# EAGLE design T32 ref (EAGLE 6.6.0)
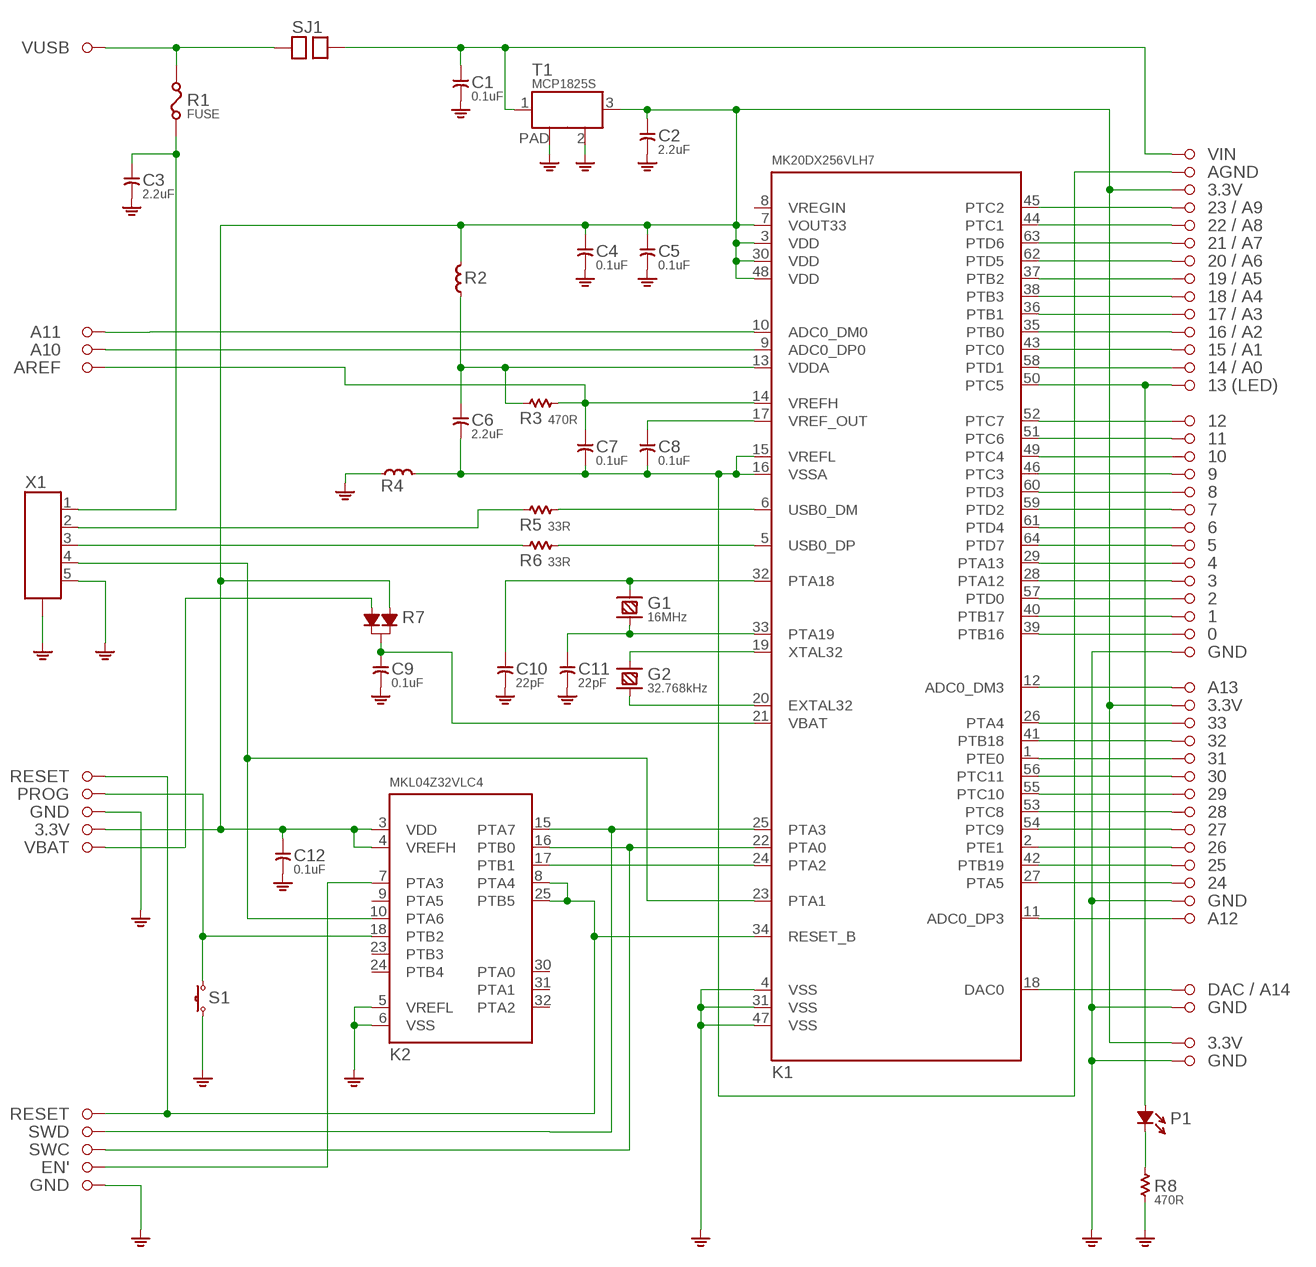
[diagram p0: schematic, sheet 1]

## Parts
C1  0.1uF  CAPACITOR-0.1UF  [C0603]
C2  2.2uF  CAPACITOR-2.2UF  [C0805]
C3  2.2uF  CAPACITOR-2.2UF  [C0805]
C4  0.1uF  CAPACITOR-0.1UF  [C0603]
C5  0.1uF  CAPACITOR-0.1UF  [C0603]
C6  2.2uF  CAPACITOR-2.2UF  [C0805]
C7  0.1uF  CAPACITOR-0.1UF  [C0603]
C8  0.1uF  CAPACITOR-0.1UF  [C0603]
C9  0.1uF  CAPACITOR-0.1UF  [C0603]
C10  22pF  CAPACITOR-22PF  [C0603]
C11  22pF  CAPACITOR-22PF  [C0603]
C12  0.1uF  CAPACITOR-0.1UF  [C0603]
G1  16MHz  CRYSTAL-HC49US  [HC49US]
G2  32.768kHz  CRYSTAL-TC26H  [TC26H]
K1  MK20DX256VLH7  [LQFP64-05]
K2  MKL04Z32VLC4  [LQFP32-08]
P1  LED  [LED-0805]
R1  FUSE  [F0805]
R2  FERRITE  [L0603]
R3  470R  RESISTOR-470R  [R0603]
R4  FERRITE  [L0603]
R5  33R  RESISTOR-33R  [R0603]
R6  33R  RESISTOR-33R  [R0603]
R7  DIODE_DUAL  [SOT-23]
R8  470R  RESISTOR-470R  [R0603]
S1  TACT_SWITCH  [ALPS_SKHH]
SJ1  SOLDERJUMPER  [SOLDERJUMPER]
SX1  PIN  [PTH_39MIL]
SX2  PIN  [PTH_39MIL]
SX3  PIN  [PTH_39MIL]
SX4  PIN  [PTH_39MIL]
SX5  PIN  [PTH_39MIL]
SX6  PIN  [PTH_39MIL]
SX7  PIN  [PTH_39MIL]
SX8  PIN  [PTH_39MIL]
SX9  PIN  [PTH_39MIL]
SX10  PIN  [PTH_39MIL]
SX11  PIN  [PTH_39MIL]
SX12  PIN  [PTH_39MIL]
SX13  PIN  [PTH_39MIL]
SX14  PIN  [PTH_39MIL]
SX15  PIN  [PTH_39MIL]
SX16  PIN  [PTH_39MIL]
SX17  PIN  [PTH_39MIL]
SX18  PIN  [PTH_39MIL]
SX19  PIN  [PTH_39MIL]
SX20  PIN  [PTH_39MIL]
SX21  PIN  [PTH_39MIL]
SX22  PIN  [PTH_39MIL]
SX23  PIN  [PTH_39MIL]
SX24  PIN  [PTH_39MIL]
SX25  PIN  [PTH_39MIL]
SX26  PIN  [PTH_39MIL]
SX27  PIN  [PTH_39MIL]
SX28  PIN  [PTH_39MIL]
SX29  PIN  [PTH_39MIL]
SX30  PIN  [PTH_39MIL]
SX31  PIN  [PTH_39MIL]
SX32  PIN  [PTH_39MIL]
SX33  PIN  [PTH_39MIL]
SX34  PIN  [PTH_39MIL]
SX35  PIN  [PTH_39MIL]
SX36  PIN  [PTH_39MIL]
SX37  PIN  [PTH_39MIL]
SX38  PIN  [PTH_39MIL]
SX39  PIN  [PTH_39MIL]
SX40  PIN  [PTH_39MIL]
SX41  PIN  [PTH_39MIL]
SX42  PIN  [PTH_39MIL]
SX43  PIN  [PTH_39MIL]
SX44  PIN  [PTH_39MIL]
SX45  PIN  [PTH_39MIL]
SX46  PIN  [PTH_39MIL]
SX47  PIN  [PTH_39MIL]
SX48  PIN  [PTH_39MIL]
SX49  PIN  [PTH_39MIL]
SX50  PIN  [PTH_39MIL]
SX51  PIN  [PTH_39MIL]
SX52  PIN  [PTH_39MIL]
SX53  PIN  [PTH_39MIL]
SX54  PIN  [PTH_39MIL]
SX55  PIN  [PTH_39MIL]
SX56  PIN  [PTH_39MIL]
SX57  PIN  [PTH_39MIL]
SX58  PIN  [PTH_39MIL]
SX59  PIN  [PTH_39MIL]
SX60  PIN  [PTH_39MIL]
T1  MCP1825S  LDO  [SOT-223]
X1  MINI-USB  MINI-USBMOLEX_0675031230  [MOLEX_SD-67503-010]

## Nets
GND: C1.2 C2.2 C3.2 C4.2 C5.2 C9.2 C10.2 C11.2 C12.2 K1.4(VSS) K1.31(VSS) K1.47(VSS) K2.5(VREFL) K2.6(VSS) R4.1 R8.1 S1.3 S1.4 SX32.1 SX42.1 SX50.1 SX53.1 SX55.1 SX60.1 T1.2(GND) T1.PAD X1.5 X1.P$1(CASE) X1.P$2(CASE) X1.P$3(CASE) X1.P$4(CASE) X1.P$5(CASE) X1.P$6(CASE)
N$1: K2.7(PTA3) SX59.1
N$2: K1.22(PTA0) K2.16(PTB0) SX58.1
N$3: K1.24(PTA2) K2.17(PTB1)
N$5: C10.1 G1.1 K1.32(PTA18)
N$6: C11.1 G1.2 K1.33(PTA19)
N$7: G2.2 K1.19(XTAL32)
N$8: G2.1 K1.20(EXTAL32)
N$9: K2.18(PTB2) S1.1 S1.2 SX40.1
N$10: K1.5(USB0_DP) R6.2
N$11: C8.1 K1.17(VREF_OUT)
N$12: K1.34(RESET_B) K2.8(PTA4) K2.25(PTB5) SX38.1 SX56.1
N$13: C7.1 K1.14(VREFH) R3.2 SX16.1
N$14: K1.6(USB0_DM) R5.2
N$15: C6.1 K1.13(VDDA) R2.1 R3.1
N$16: R6.1 X1.3
N$17: R5.1 X1.2
N$18: C3.1 R1.1 X1.1
N$19: K1.23(PTA1) K2.10(PTA6) X1.4
N$21: K1.45(PTC2) SX5.1
N$22: K1.44(PTC1) SX6.1
N$23: K1.63(PTD6) SX7.1
N$24: K1.62(PTD5) SX8.1
N$25: K1.37(PTB2) SX9.1
N$26: K1.38(PTB3) SX10.1
N$27: K1.36(PTB1) SX11.1
N$28: K1.35(PTB0) SX13.1
N$29: K1.43(PTC0) SX15.1
N$30: K1.58(PTD1) SX17.1
N$31: K1.50(PTC5) P1.+ SX18.1
N$32: K1.52(PTC7) SX19.1
N$33: K1.51(PTC6) SX20.1
N$34: K1.49(PTC4) SX21.1
N$35: K1.46(PTC3) SX22.1
N$36: K1.60(PTD3) SX23.1
N$37: K1.59(PTD2) SX24.1
N$38: K1.61(PTD4) SX25.1
N$39: K1.64(PTD7) SX26.1
N$40: K1.29(PTA13) SX27.1
N$41: K1.28(PTA12) SX28.1
N$42: K1.57(PTD0) SX29.1
N$43: K1.40(PTB17) SX30.1
N$44: K1.39(PTB16) SX31.1
N$45: K1.12(ADC0_DM3) SX33.1
N$46: K1.26(PTA4) SX35.1
N$47: K1.41(PTB18) SX36.1
N$48: K1.1(PTE0) SX37.1
N$49: K1.56(PTC11) SX39.1
N$50: K1.55(PTC10) SX41.1
N$51: K1.53(PTC8) SX43.1
N$52: P1.- R8.2
N$53: C6.2 C7.2 C8.2 K1.15(VREFL) K1.16(VSSA) R4.2 SX3.1
N$54: K1.18(DAC0) SX52.1
N$55: K1.11(ADC0_DP3) SX51.1
N$57: K1.27(PTA5) SX49.1
N$58: K1.42(PTB19) SX48.1
N$59: K1.2(PTE1) SX47.1
N$60: K1.54(PTC9) SX45.1
N$61: C1.1 SJ1.2 SX2.1 T1.1(IN)
N$63: R7.2 SX46.1
N$64: K1.10(ADC0_DM0) SX12.1
N$65: K1.9(ADC0_DP0) SX14.1
N$67: R1.2 SJ1.1 SX1.1
N$68: C9.1 K1.21(VBAT) R7.3
N$69: C2.1 C4.1 C5.1 C12.1 K1.3(VDD) K1.7(VOUT33) K1.30(VDD) K1.48(VDD) K2.3(VDD) K2.4(VREFH) R2.2 R7.1 SX4.1 SX34.1 SX44.1 SX54.1 T1.3(OUT)
N$70: K1.25(PTA3) K2.15(PTA7) SX57.1
Unconnected: K1.8(VREGIN) K2.9(PTA5) K2.23(PTB3) K2.24(PTB4) K2.30(PTA0) K2.31(PTA1) K2.32(PTA2)

## Notes on the sheet
- VUSB
- VIN
- AGND
- 3.3V
- 23 / A9
- 22 / A8
- 21 / A7
- 20 / A6
- 19 / A5
- 18 / A4
- 17 / A3
- A11 | 16 / A2
- A10 | 15 / A1
- AREF | 14 / A0
- 13 (LED)
- 12
- 11
- 10
- 9
- 8
- 7
- 6
- 5
- 4
- 3
- 2
- 1
- 0
- GND
- A13
- 3.3V
- 33
- 32
- 31
- RESET | 30
- PROG | 29
- GND | 28
- 3.3V | 27
- VBAT | 26
- 25
- 24
- GND
- A12
- DAC / A14
- GND
- 3.3V
- GND
- RESET
- SWD
- SWC
- EN'
- GND

## Library data of the parts
C1 C4 C5 C7-C9 C12 = t32_ref:CAPACITOR-0.1UF; DESC: 0.1uF / 10VDC / X7R; MF: Murata Electronics; MPN: GRM155R71A104KA01D; OC_MOUSER: 81-GRM155R71A104KA1D; PACKAGE: 0603; TYPE: Capacitor
C2 C3 C6 = t32_ref:CAPACITOR-2.2UF; DESC: 2.2uF / 25 VDC / X7R; MF: Taiyo Yuden; MPN: TMK212B7225KG-TR; OC_MOUSER: 963-TMK212B7225KG-TR; PACKAGE: 0805; TYPE: Capacitor
C10 C11 = t32_ref:CAPACITOR-22PF; DESC: 22pF / 50VDC / C0G (NP0); MF: Vishay / Vitramon; MPN: VJ0603A220JXACW1BC; OC_MOUSER: 77-VJ0603A220JXACBC; PACKAGE: 0603; TYPE: Capacitor
G1 = t32_ref:CRYSTAL-; DESC: 16MHz / 18pF / 10ppm; MF: ABRACON; MPN: ABL-16.000MHz-B1U; OC_MOUSER: 815-ABL-16-B1U; PACKAGE: HC-49US; TYPE: Crystal
G2 = t32_ref:CRYSTAL-; DESC: 32.768kHz / 12.5pF / 20ppm; MF: Citizen FineDevice; MPN: CFS206-32.768KDZF-UB; OC_MOUSER: 695-CFS206-327KF-U; PACKAGE: TC-26H; TYPE: Crystal
K1 = t32_ref:MK20DX256VLH7; DESC: MK20DX256VLH7; MF: NXP; MPN: MK20DX256VLH7; OC_MOUSER: 841-MK20DX256VLH7; PACKAGE: LQFP-64; TYPE: Microcontroller
K2 = t32_ref:MKL04Z32VLC4; DESC: MKL04Z32VLC4 (preprogrammed); MF: PJRC; MPN: IC_MKL04Z32_TQFP32; PACKAGE: LQFP-32; TYPE: Microcontroller
P1 = t32_ref:LED; DESC: orange; MF: ROHM Semiconductor; MPN: SML-211DTT86; OC_MOUSER: 755-SML-211DTT86; PACKAGE: 0805; TYPE: LED
R1 = t32_ref:FUSE; DESC: 6V / 0.5A; MF: Bel Fuse; MPN: 0ZCK0050FF2E; OC_MOUSER: 530-0ZCK0050FF2E; PACKAGE: 0805; TYPE: PPTC
R2 R4 = t32_ref:FERRITE; DESC: 600R / 100MHz; MF: Murata Electronics; MPN: BLM18AG601SN1D; OC_MOUSER: 81-BLM11A601S; PACKAGE: 0603; TYPE: Ferrite
R3 R8 = t32_ref:RESISTOR-470R; DESC: 470R / 1 % / 0.1 W; MF: Vishay; MPN: CRCW0603470RFKEA; OC_MOUSER: 71-CRCW0603-470-E3; PACKAGE: 0603; TYPE: Resistor
R5 R6 = t32_ref:RESISTOR-33R; DESC: 33R / 1% / 0.25 W; MF: Panasonic; MPN: ERJ-PA3F33R0V; OC_MOUSER: 667-ERJ-PA3F33R0V; PACKAGE: 0603; TYPE: Resistor
R7 = t32_ref:DIODE_DUAL; DESC: Dual Schottky, common cat; MF: NXP Semiconductors; MPN: BAT54C,215; OC_MOUSER: 771-BAT54C-T/R; PACKAGE: SOT-23; TYPE: Diode
S1 = t32_ref:TACT_SWITCH; DESC: SPST; MF: ALPS; MPN: SKHHPKA010; OC_MOUSER: 688-SKHHPK; PACKAGE: 6x6x5 MM; TYPE: Tactile switch
SJ1 = t32_ref:SOLDERJUMPER
SX1-SX60 = t32_ref:PIN
T1 = t32_ref:LDO; DESC: 3.3V 500mA; MF: Microchip Technology; MPN: MCP1825S-3302E/DB; OC_MOUSER: 579-MCP1825S-3302EDB; PACKAGE: SOT-223-3; TYPE: Voltage regulator
X1 = t32_ref:MINI-USB; DESC: MINI USB; MF: MOLEX; MPN: 0675031020; OC_MOUSER: 538-67503-1020; TYPE: Mini USB

## Board
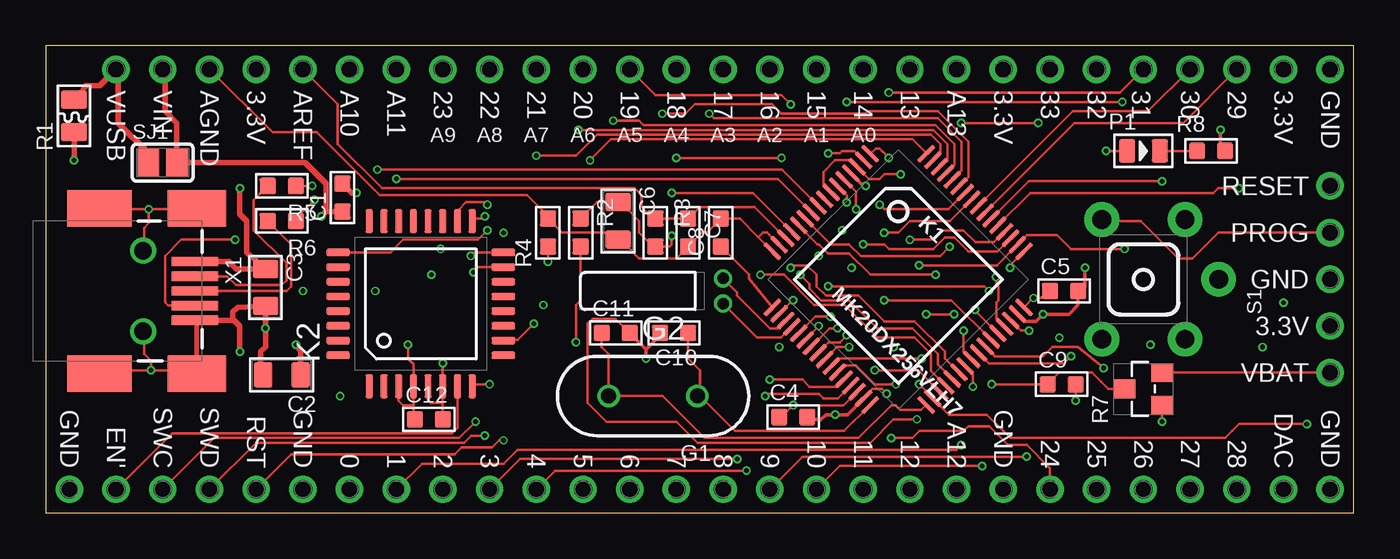
[diagram p1: board, top side]
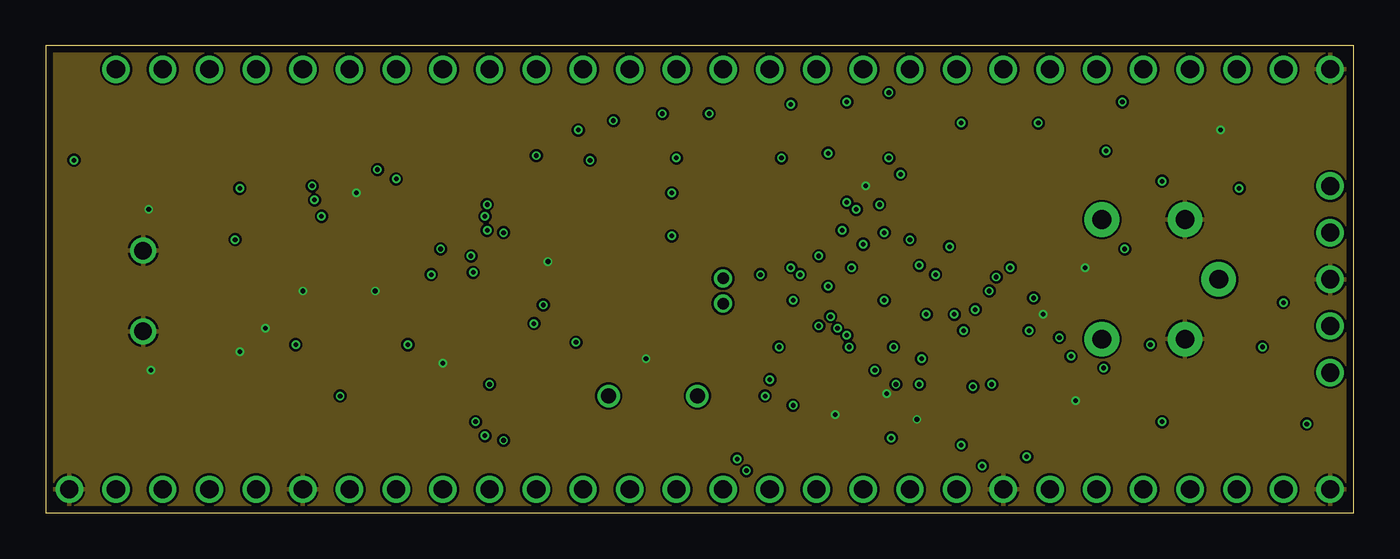
[diagram p2: board, inner layer Route2]
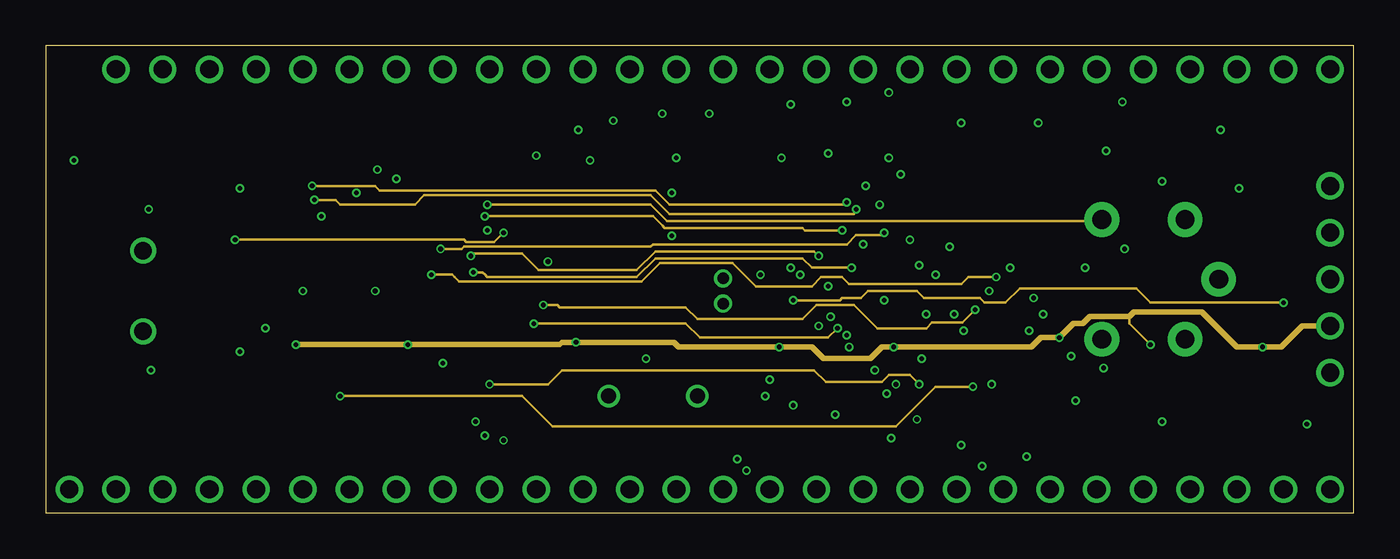
[diagram p3: board, inner layer Route15]
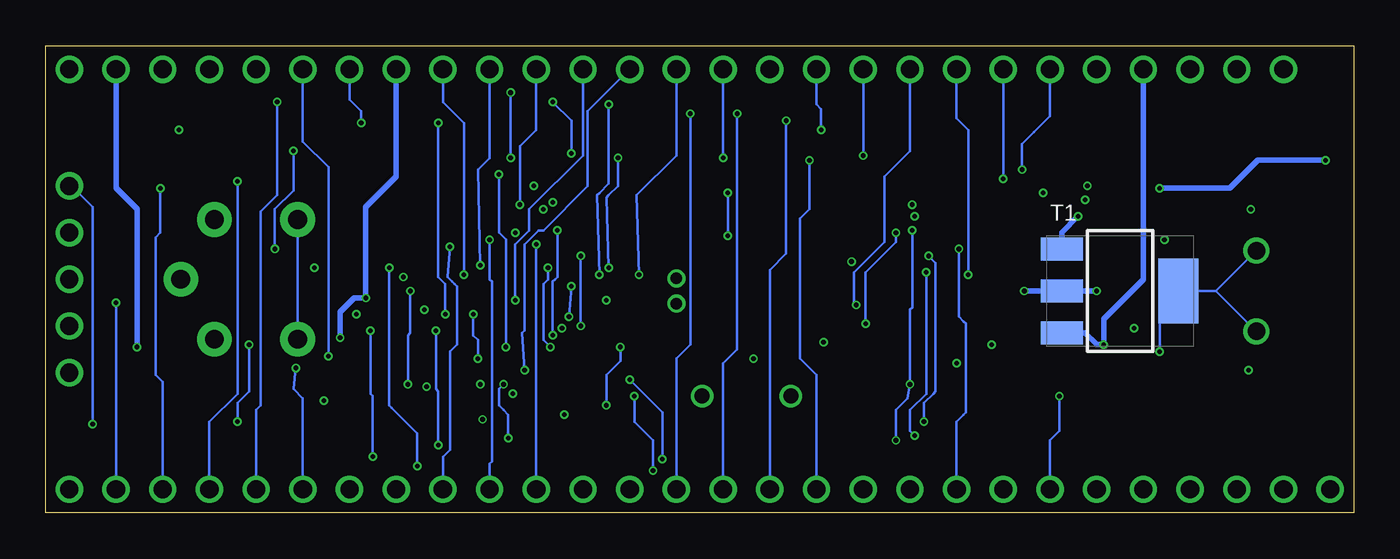
[diagram p4: board, bottom side, seen from below]

Size 71.12 x 25.4 mm. Coordinates in mm from the lower left corner, seen from the top.
Outline: 0,0 71.12,0 71.12,25.4 0,25.4 0,0
Copper layers (1+2*15+16): Top 0.035559375mm / dielectric 0.17018125mm / Route2 0.01778125mm / dielectric 47mil / Route15 0.01778125mm / dielectric 0.17018125mm / Bottom 0.035559375mm
Design rules "oshpark-4layer *": minimum track width 5mil, minimum drill 10mil, track to track 5mil, track to pad 5mil, pad to pad 5mil, via to via 5mil, smd to smd 5mil, copper to edge 15mil, drill to drill 5mil, minimum pad ring 7mil, minimum via ring 4mil, stop-mask expansion 3mil, vias tented up to drill 20mil, thermal gap 5mil

### Footprints (pad centres in the part's own frame; a part is rotated, then mirrored left to right if it is on the bottom)
C0603 = smd 0.889 x 0.889: 1 0,0.762; 2 0,-0.762
C0805 = smd 1.397 x 1.016: 1 0,1.016; 2 0,-1.016
HC49US = drill 0.813: 1 -2.413,0; 2 2.413,0
TC26H = drill 0.635: 1 -0.686,0; 2 0.686,0
LQFP64-05 = smd 1.2 x 0.25: 1 -5.915,3.759; 2 -5.915,3.251; 3 -5.915,2.743; 4 -5.915,2.261; 5 -5.915,1.753; 6 -5.915,1.245; 7 -5.915,0.762; 8 -5.915,0.254; 9 -5.915,-0.254; 10 -5.915,-0.762; 11 -5.915,-1.245; 12 -5.915,-1.753; 13 -5.915,-2.261; 14 -5.915,-2.743; 15 -5.915,-3.251; 16 -5.915,-3.759; 33 5.915,-3.759; 34 5.915,-3.251; 35 5.915,-2.743; 36 5.915,-2.261; 37 5.915,-1.753; 38 5.915,-1.245; 39 5.915,-0.762; 40 5.915,-0.254; 41 5.915,0.254; 42 5.915,0.762; 43 5.915,1.245; 44 5.915,1.753; 45 5.915,2.261; 46 5.915,2.743; 47 5.915,3.251; 48 5.915,3.759 | smd 0.25 x 1.2: 17 -3.759,-5.915; 18 -3.251,-5.915; 19 -2.743,-5.915; 20 -2.261,-5.915; 21 -1.753,-5.915; 22 -1.245,-5.915; 23 -0.762,-5.915; 24 -0.254,-5.915; 25 0.254,-5.915; 26 0.762,-5.915; 27 1.245,-5.915; 28 1.753,-5.915; 29 2.261,-5.915; 30 2.743,-5.915; 31 3.251,-5.915; 32 3.759,-5.915; 49 3.759,5.915; 50 3.251,5.915; 51 2.743,5.915; 52 2.261,5.915; 53 1.753,5.915; 54 1.245,5.915; 55 0.762,5.915; 56 0.254,5.915; 57 -0.254,5.915; 58 -0.762,5.915; 59 -1.245,5.915; 60 -1.753,5.915; 61 -2.261,5.915; 62 -2.743,5.915; 63 -3.251,5.915; 64 -3.759,5.915
LQFP32-08 = smd 1.3 x 0.4: 1 -4.493,2.8; 2 -4.493,2; 3 -4.493,1.2; 4 -4.493,0.4; 5 -4.493,-0.4; 6 -4.493,-1.2; 7 -4.493,-2; 8 -4.493,-2.8; 17 4.493,-2.8; 18 4.493,-2; 19 4.493,-1.2; 20 4.493,-0.4; 21 4.493,0.4; 22 4.493,1.2; 23 4.493,2; 24 4.493,2.8 | smd 0.4 x 1.3: 9 -2.8,-4.493; 10 -2,-4.493; 11 -1.2,-4.493; 12 -0.4,-4.493; 13 0.4,-4.493; 14 1.2,-4.493; 15 2,-4.493; 16 2.8,-4.493; 25 2.8,4.493; 26 2,4.493; 27 1.2,4.493; 28 0.4,4.493; 29 -0.4,4.493; 30 -1.2,4.493; 31 -2,4.493; 32 -2.8,4.493
LED-0805 = smd 0.889 x 1.27: + -0.889,0; - 0.889,0
F0805 = smd 1.397 x 1.016: 1 0,0.889; 2 0,-0.889
L0603 = smd 0.889 x 0.889: 1 -0.762,0; 2 0.762,0
R0603 = smd 0.889 x 0.889: 1 0,0.762; 2 0,-0.762
SOT-23 = smd 1.016 x 1.143: 1 -0.889,-1.016; 2 0.889,-1.016; 3 0,1.016
ALPS_SKHH = drill 1.016 pad 1.88: 1 -3.251,2.261; 2 3.251,2.261; 3 -3.251,-2.261; 4 3.251,-2.261; 5 0,-4.1
SOLDERJUMPER = smd 1.168 x 1.6: 1 -0.762,0; 2 0.762,0
PTH_39MIL = drill 0.991: 1 0,0
SOT-223 = smd 1.27 x 2.286: 1 -2.286,-3.175; 2 0,-3.175; 3 2.286,-3.175 | smd 3.556 x 2.159: PAD 0,3.175
MOLEX_SD-67503-010 = smd 2.54 x 0.508: 1 2.819,1.6; 2 2.819,0.8; 3 2.819,0; 4 2.819,-0.8; 5 2.819,-1.6 | smd 3.5 x 2: P$1 -2.375,-4.5; P$2 -2.375,4.5 | smd 3.2 x 2: P$3 2.925,-4.5; P$4 2.925,4.5 | drill 0.95: P$5 0,2.2; P$6 0,-2.2

### Placement (x,y rotation side)
C1  16.13,17.14 180 top
C2  12.83,7.49 270 top
C3  11.94,12.26 0 top
C4  40.64,5.21 90 top
C5  55.37,12.06 90 top
C6  31.11,15.88 0 top
C7  34.92,15.24 0 top
C8  36.7,15.24 180 top
C9  55.24,6.99 90 top
C10  34.16,9.78 270 top
C11  30.99,9.78 90 top
C12  20.83,5.08 90 top
G1  33.02,6.35 180 top
G2  36.83,12.06 90 top
K1  46.35,12.7 315 top
K2  20.38,11.37 90 top
P1  59.69,19.68 0 top
R1  1.52,21.59 180 top
R2  29.08,15.24 270 top
R3  33.15,15.24 180 top
R4  27.3,15.24 90 top
R5  12.83,17.78 90 top
R6  12.83,15.88 90 top
R7  59.69,6.73 90 top
R8  63.37,19.68 270 top
S1  59.69,12.7 90 top
SJ1  6.35,19.05 0 top
SX1  3.81,24.13 0 top
SX2  6.35,24.13 0 top
SX3  8.89,24.13 0 top
SX4  11.43,24.13 0 top
SX5  21.59,24.13 0 top
SX6  24.13,24.13 0 top
SX7  26.67,24.13 0 top
SX8  29.21,24.13 0 top
SX9  31.75,24.13 0 top
SX10  34.29,24.13 0 top
SX11  36.83,24.13 0 top
SX12  19.05,24.13 0 top
SX13  39.37,24.13 0 top
SX14  16.51,24.13 0 top
SX15  41.91,24.13 0 top
SX16  13.97,24.13 0 top
SX17  44.45,24.13 0 top
SX18  46.99,24.13 0 top
SX19  46.99,1.27 0 top
SX20  44.45,1.27 0 top
SX21  41.91,1.27 0 top
SX22  39.37,1.27 0 top
SX23  36.83,1.27 0 top
SX24  34.29,1.27 0 top
SX25  31.75,1.27 0 top
SX26  29.21,1.27 0 top
SX27  26.67,1.27 0 top
SX28  24.13,1.27 0 top
SX29  21.59,1.27 0 top
SX30  19.05,1.27 0 top
SX31  16.51,1.27 0 top
SX32  13.97,1.27 0 top
SX33  49.53,24.13 0 top
SX34  52.07,24.13 0 top
SX35  54.61,24.13 0 top
SX36  57.15,24.13 0 top
SX37  59.69,24.13 0 top
SX38  69.85,17.78 0 top
SX39  62.23,24.13 0 top
SX40  69.85,15.24 0 top
SX41  64.77,24.13 0 top
SX42  69.85,12.7 0 top
SX43  64.77,1.27 0 top
SX44  69.85,10.16 0 top
SX45  62.23,1.27 0 top
SX46  69.85,7.62 0 top
SX47  59.69,1.27 0 top
SX48  57.15,1.27 0 top
SX49  54.61,1.27 0 top
SX50  52.07,1.27 0 top
SX51  49.53,1.27 0 top
SX52  67.31,1.27 0 top
SX53  1.27,1.27 0 top
SX54  67.31,24.13 0 top
SX55  69.85,24.13 0 top
SX56  11.43,1.27 0 top
SX57  8.89,1.27 0 top
SX58  6.35,1.27 0 top
SX59  3.81,1.27 0 top
SX60  69.85,1.27 0 top
T1  12.7,12.06 270 bottom
X1  5.29,12.06 0 top

### Tracks (layer width: path | path; a pad name or v marks a point on that pad's centre or on a via)
GND  (via drill 0.25)
  Top 0.127: 21.58,5.97 K2.6 v21.58,8.12 v21.59,8.13 | 21.58,5.97 21.58,5.16 C12.2 | K2.5 20.78,6.14 20.95,5.97 21.58,5.97 | C4.2 41.53,5.08 | C10.2 33.4,9.65 | v47.37,5.08 46.1,5.08 44.83,3.81 35.43,3.81 34.29,4.95 30.48,4.95 29.46,5.97 29.46,10.29 29.72,10.54 30.99,10.54 C11.2 | 11.68,7.75 C2.2 | C5.2 56.52,12.32 | C9.2 v56.01,6.1 | K1.47 52.7,10.93 | R4.1 v27.3,13.66 | R8.1 64.14,19.81 63.88,20.07 | C1.2 16.26,17.91 | 44.45,6.22 44.7,6.48 44.96,6.73 45.09,6.73 45.21,6.73 45.47,6.73 v45.72,6.48 | v5.59,16.51 2.97,16.51 X1.P$2 | v5.59,16.51 8.16,16.51 X1.P$4 | v5.71,7.75 8.03,7.75 X1.P$3 | v5.71,7.75 3.09,7.75 X1.P$1 | v5.71,7.75 5.71,8.26 5.33,8.64 5.33,9.91 | v5.59,16.51 5.59,15.75 5.33,15.49 5.33,14.22
  Top 0.203: 41.53,5.08 42.16,5.08 42.42,5.33 v42.93,5.33 43.59,5.33 K1.31 | C11.2 32.64,8.89 | 33.4,9.65 32.64,8.89 | 32.64,8.89 v32.64,8.38 | 56.52,12.32 v56.52,13.34 | 52.7,10.93 53.21,10.41 53.85,10.41 v54.23,10.79 55.63,10.79 56.13,11.3 C5.2 | 63.88,20.07 v63.88,20.83 | K1.4 44.47,17.78 v44.58,17.78
  Top 0.254: X1.P$3 8.21,10.5 8.26,10.54
  Top 0.305: 11.68,7.75 11.68,8.76 11.94,9.02 v11.94,10.03 C3.2 10.41,11.18 10.16,10.92 10.16,10.54 | X1.5 10.24,10.46 10.54,10.16 v10.54,8.76 | v16.89,17.4 16.64,17.4 C1.2
  Route2 0.127: v42.93,5.33 42.93,5.46
  Bottom 0.127: v10.54,8.76 10.54,10.41 9.53,11.43 T1.PAD 7.49,12.06 | 5.33,14.22 7.49,12.06 | 5.33,9.91 7.49,12.06
  Bottom 0.305: v17.91,12.06 T1.2 v13.97,12.06
  pour Route2: -3.56,27.56 -3.68,27.56 -3.68,-2.03 76.71,-2.03 76.71,27.69 -3.56,27.69
N$1
  Top 0.127: SX59.1 6.86,4.32 9.4,4.32 22.1,4.32 22.38,4.6 K2.7
N$2  (via drill 0.25)
  Top 0.127: SX58.1 9.14,4.06 22.48,4.06 v23.37,4.95 | 23.24,14.1 v23.11,13.97 23.31,14.17 K2.16 | K1.22 41.43,9.56 v42.04,10.16
  Route15 0.127: v42.04,13.97 41.78,14.22 33.15,14.22 32.13,13.21 26.8,13.21 25.91,14.1 23.24,14.1 v23.11,13.97
  Bottom 0.127: v23.37,4.95 23.37,5.97 22.86,6.48 22.73,6.6 22.73,13.59 v23.11,13.97 | v42.04,10.16 42.04,13.84 v42.04,13.97
N$3  (via drill 0.25)
  Top 0.127: 42.13,8.86 K1.24 42.57,9.27 43.18,9.27 v43.56,9.65 | v23.88,16.13 23.75,16 23.27,16 K2.17
  Route15 0.127: v43.31,15.37 41.27,15.37 41.15,15.49 38.61,15.49 33.66,15.49 33.53,15.62 33.02,16.13 v23.88,16.13
  Bottom 0.127: v43.56,9.65 43.56,12.57 43.43,12.7 43.31,12.83 v43.31,15.37
N$5
  Top 0.127: C10.1 34.92,8.38 35.56,7.75 35.56,6.48 G1.1 35.56,6.35 37.47,4.45 43.42,4.45 K1.32
N$6
  Top 0.127: C11.1 30.23,9.02 30.61,8.64 G1.2 33.53,6.35 35.81,4.06 44.2,4.06 45.97,5.84 46.23,5.84 46.48,5.59 47.58,5.59 K1.33
N$7
  Top 0.127: K1.19 39.81,10.03 39.5,10.03 39.37,10.03 37.59,11.81 37.59,11.99 G2.2
N$8
  Top 0.127: K1.20 39.98,9.53 38.73,9.53 38.68,9.53 G2.1
N$9  (via drill 0.25)
  Top 0.127: SX40.1 63.75,15.24 62.36,13.84 61.59,13.84 59.56,15.88 57.99,15.88 S1.2 | K2.18 22.38,16.41 22.86,16.89 23.88,16.89 v24,16.76
  Route15 0.127: v24,16.76 32.89,16.76 33.78,15.88 41.4,15.88 41.66,15.88 41.91,15.88 56.84,15.88 S1.2
  Bottom 0.127: S1.1 S1.2
N$10  (via drill 0.25)
  Top 0.127: R6.2 13.59,16 v14.61,17.02 | v44.07,16.51 44.07,17.46 K1.5
  Route15 0.127: v14.61,17.02 15.75,17.02 16,16.76 20.07,16.76 20.57,17.27 32.89,17.27 33.91,16.26 41.91,16.26 42.16,16.26 43.94,16.26 v44.07,16.51
N$11
  Top 0.127: K1.17 38.23,12.75 38.23,12.95 C8.1
N$12  (via drill 0.25)
  Top 0.127: SX56.1 13.34,3.17 22.23,3.17 22.61,3.56 24.26,3.56 24.64,3.94 v24.89,3.94 | v24.13,6.99 23.27,6.99 K2.8 | v24,15.37 23.5,14.86 19.43,14.86 18.74,14.17 K2.25 | v47.5,6.99 48.1,6.39 K1.34 49.12,5.33 51.18,5.33 52.07,4.45 52.45,4.06 64.14,4.06 64.52,4.45 64.9,4.83 v68.58,4.83
  Route15 0.127: v24.13,6.99 27.3,6.99 28.07,7.75 41.78,7.75 42.42,7.11 45.47,7.11 45.85,7.49 46.99,7.49 v47.5,6.99
  Bottom 0.127: v24.89,3.94 24.89,5.59 24.26,6.22 v24.13,6.99 24.13,11.05 24,11.18 v24,15.37 | SX38.1 69.72,17.78 68.58,16.64 v68.58,4.83
N$13
  Top 0.127: SX16.1 15.88,22.23 15.88,20.07 18.29,17.65 32,17.65 32.38,17.27 32.38,16.64 33.02,16 R3.2 C7.1 35.56,16.64 38.54,16.64 K1.14
N$14  (via drill 0.25)
  Top 0.127: R5.2 v14.48,17.78 | v43.56,16.89 43.56,17.25 K1.6
  Route15 0.127: v14.48,17.78 17.91,17.78 18.16,17.53 33.15,17.53 33.91,16.76 38.48,16.76 38.73,16.76 43.43,16.76 v43.56,16.89
N$15  (via drill 0.25)
  Top 0.127: K1.13 38.46,17.4 35.94,17.4 v34.04,17.4 | v34.04,15.06 34.04,14.61 33.91,14.48 R3.1 33.02,14.48 32.26,15.24 32.26,15.88 31.62,16.51 31.5,16.51 C6.1 29.97,16.89 R2.1
  Bottom 0.127: v34.04,17.4 v34.04,15.06
N$16
  Top 0.127: X1.3 13.08,12.06 13.34,12.32 13.34,14.61 R6.1
N$17
  Top 0.127: X1.2 9.87,12.87 10.35,12.38 12.83,12.38 13.08,12.64 13.08,13.59 11.3,15.37 11.3,17.02 R5.1
N$18  (via drill 0.25)
  Top 0.305: R1.1 v1.52,19.18 | v10.54,17.65 10.54,16.26 10.92,15.88 10.92,14.16 C3.1 10.35,13.27 9.96,13.66 X1.1
  Bottom 0.305: v1.52,19.18 5.21,19.18 6.73,17.65 v10.54,17.65
N$19  (via drill 0.25)
  Top 0.127: K2.10 24.71,9.4 25.65,9.4 v26.54,10.29 | 10.16,14.73 v10.29,14.86 7.37,14.86 6.48,13.97 6.48,13.21 6.48,11.43 6.64,11.27 X1.4 | v43.05,10.03 42.61,10.03 K1.23
  Route15 0.127: v24.89,15.24 24.38,14.73 22.86,14.73 22.73,14.86 17.14,14.86 v10.29,14.86 | v26.54,10.29 34.8,10.29 35.56,9.53 42.55,9.53 v43.05,10.03
  Bottom 0.127: v24.89,15.24 24.89,14.73 26.54,13.08 v26.54,10.29
N$21  (via drill 0.25)
  Top 0.127: K1.45 51.69,10.56 51.69,10.94 51.69,11.07 51.69,11.43 51.82,11.56 51.82,12.32 51.69,12.45 v51.69,12.83
  Route15 0.127: v51.69,12.83 50.16,12.83 49.78,12.45 43.69,12.45 43.31,12.83 42.16,12.83 41.66,12.32 38.61,12.32 37.34,13.59 33.4,13.59 32.38,12.57 22.48,12.57 22.23,12.83 22.1,12.95 v20.95,12.95
  Bottom 0.127: SX5.1 21.59,21.46 20.95,20.83 v20.95,12.95
N$22  (via drill 0.25)
  Top 0.127: K1.44 50.55,10.99 v50.55,11.05
  Route15 0.127: v50.55,11.05 49.85,10.35 48.2,10.35 47.88,10.03 45.21,10.03 43.94,11.3 41.91,11.3 41.15,10.54 40.77,10.54 36.07,10.54 35.43,10.54 34.8,11.18 27.94,11.18 27.81,11.3 v27.05,11.3
  Bottom 0.127: SX6.1 24.13,19.68 25.53,18.29 25.53,14.73 27.18,13.08 27.18,11.43 v27.05,11.3
N$23  (via drill 0.25)
  Top 0.127: v26.67,19.43 28.83,19.43 29.97,20.57 48.13,20.57 48.64,20.07 48.64,19.58 K1.63
  Bottom 0.127: SX7.1 v26.67,19.43
N$24  (via drill 0.25)
  Top 0.127: v28.96,20.83 48.26,20.83 49.02,20.07 49.02,19.25 K1.62
  Bottom 0.127: SX8.1 29.21,22.23 28.96,21.97 v28.96,20.83
N$25  (via drill 0.25)
  Top 0.127: SX9.1 33.15,22.73 40.01,22.73 v40.51,22.23 | v41.02,12.95 41.53,12.45 41.53,12.19 42.16,11.56 43.69,11.56 45.21,10.03 47.12,10.03 48.51,8.64 48.51,8.06 K1.37
  Bottom 0.127: v40.51,22.23 40.51,17.91 41.02,17.4 41.15,17.27 v41.02,12.95
N$26  (via drill 0.25)
  Top 0.127: v34.29,19.3 v40.01,19.3 | K1.38 48.9,8.4 48.9,8.76 47.24,10.41 45.59,10.41 44.2,11.81 42.42,11.81 41.91,12.32 41.91,12.95 41.4,13.46 40.64,13.46 v40.51,13.34
  Bottom 0.127: SX10.1 v34.29,19.3 | v40.01,19.3 40.01,17.78 40.51,17.27 40.64,17.14 v40.51,13.34
N$27  (via drill 0.25)
  Top 0.127: v38.86,12.95 40.13,12.95 41.78,11.3 43.43,11.3 45.21,9.53 47.24,9.53 48.13,8.64 48.13,7.72 K1.36
  Bottom 0.127: SX11.1 36.83,19.43 38.99,17.27 v38.86,12.95
N$28  (via drill 0.25)
  Top 0.127: K1.35 47.56,7.62 47.43,7.75 v45.09,7.75
  Bottom 0.127: SX13.1 41.66,21.84 41.66,17.91 41.66,17.78 44.07,15.37 44.32,15.37 45.09,14.61 45.09,9.91 45.21,9.78 v45.09,7.75
N$29  (via drill 0.25)
  Top 0.127: v45.59,11.56 49.26,11.56 K1.43
  Bottom 0.127: SX15.1 41.91,19.43 44.83,16.51 44.83,15.37 45.59,14.61 v45.59,11.56
N$30  (via drill 0.25)
  Top 0.127: K1.58 49.34,16.76 49.09,16.51 48.77,16.51 47.62,16.51 45.59,16.51 v45.34,16.76
  Bottom 0.127: SX17.1 44.45,20.83 45.34,19.94 v45.34,16.76
N$31  (via drill 0.25)
  Top 0.127: v47.5,13.46 51.72,13.46 K1.50 53.37,15.11 54.99,15.11 55.75,14.35 v58.67,14.35 | v57.66,19.68 P1.+
  Bottom 0.127: SX18.1 46.99,19.3 47.62,18.67 v47.5,13.46 | v57.66,19.68 57.66,17.53 58.67,16.51 v58.67,14.35
N$32  (via drill 0.25)
  Top 0.127: v46.99,14.86 48.26,14.86 48.77,15.37 49.91,15.37 50.55,14.73 51.44,14.73 51.56,14.73 51.97,15.14 K1.52
  Bottom 0.127: SX19.1 46.99,2.41 46.99,2.67 46.86,2.79 46.86,12.57 46.99,12.7 v46.99,14.86
N$33  (via drill 0.25)
  Top 0.127: v44.45,14.61 45.59,14.61 45.85,14.35 48.26,14.35 48.9,14.99 49.4,14.99 50.16,14.22 51.69,14.22 51.76,14.22 K1.51
  Bottom 0.127: SX20.1 v44.45,14.61
N$34  (via drill 0.25)
  Top 0.127: SX21.1 43.18,2.54 v50.93,2.54 | 53.05,14.06 K1.49 52.45,13.48 v52.45,13.34
  Bottom 0.127: v50.93,2.54 50.93,4.32 52.32,5.71 52.45,5.84 v52.45,13.34
N$35  (via drill 0.25)
  Top 0.127: SX22.1 41.15,3.05 v53.34,3.05 | v53.47,9.91 53.03,9.91 K1.46
  Bottom 0.127: v53.34,3.05 53.34,6.35 53.47,6.48 v53.47,9.91
N$36  (via drill 0.25)
  Top 0.127: v36.07,21.72 36.32,21.46 48.51,21.46 49.78,20.19 49.78,18.61 K1.60
  Bottom 0.127: SX23.1 36.83,8.38 36.07,9.14 v36.07,21.72
N$37  (via drill 0.25)
  Top 0.127: v33.53,21.72 34.8,21.72 35.31,22.23 39.5,22.23 40.01,21.72 44.58,21.72 44.7,21.84 48.51,21.84 50.16,20.19 50.16,18.27 K1.59
  Bottom 0.127: SX24.1 34.29,8.13 33.53,8.89 v33.53,21.72
N$38  (via drill 0.25)
  Top 0.127: v30.86,21.34 32.26,21.34 32.51,21.08 48.39,21.08 49.4,20.07 49.4,18.95 K1.61
  Bottom 0.127: SX25.1 31.75,13.21 30.86,14.1 v30.86,21.34
N$39  (via drill 0.25)
  Top 0.127: v29.59,19.18 30.73,20.32 47.12,20.32 47.5,19.94 47.88,19.56 K1.64
  Bottom 0.127: SX26.1 29.21,7.49 30.1,8.38 30.1,16 29.59,16.51 v29.59,19.18
N$40  (via drill 0.25)
  Top 0.127: SX27.1 27.69,2.29 v38.1,2.29 | v39.12,6.35 39.24,6.48 42.04,6.48 42.29,6.22 42.55,6.22 43.08,6.22 K1.29
  Bottom 0.127: v38.1,2.29 38.1,3.94 39.12,4.95 v39.12,6.35
N$41  (via drill 0.25)
  Top 0.127: SX28.1 25.78,2.92 30.1,2.92 v37.59,2.92 | v39.37,7.24 41.15,7.24 41.53,6.86 41.91,6.86 42.67,6.86 42.99,6.86 K1.28
  Bottom 0.127: v37.59,2.92 37.59,5.46 v39.37,7.24
N$42  (via drill 0.25)
  Top 0.127: K1.57 49.17,15.88 46.99,15.88 46.35,15.24 v45.59,15.24
  Route15 0.127: v45.59,15.24 45.47,15.11 44.07,15.11 43.56,14.61 37.08,14.61 33.02,14.61 32.89,14.48 22.73,14.48 22.61,14.35 v21.46,14.35
  Bottom 0.127: SX29.1 21.59,4.95 21.21,5.33 21.08,5.46 21.08,10.29 21.21,10.41 21.46,10.67 v21.46,14.35
N$43  (via drill 0.25)
  Top 0.127: SX30.1 20.45,2.67 24.89,2.67 25.65,3.43 49.53,3.43 v49.78,3.68 | K1.40 49.91,8.79 v49.91,9.91
  Bottom 0.127: v49.78,3.68 49.78,6.6 49.91,6.73 49.91,9.4 v49.91,9.91
N$44  (via drill 0.25)
  Top 0.127: v50.42,6.86 50.42,7.49 49.86,8.05 K1.39
  Route15 0.127: v16,6.35 25.91,6.35 27.56,4.7 46.23,4.7 48.39,6.86 v50.42,6.86
  Bottom 0.127: SX31.1 16.51,3.94 16,4.45 v16,6.35
N$45  (via drill 0.25)
  Top 0.127: v48.39,12.95 44.83,12.95 43.69,14.1 42.55,14.1 42.04,14.61 41.97,14.61 K1.12
  Bottom 0.127: SX33.1 49.53,22.35 48.39,21.21 v48.39,12.95
N$46  (via drill 0.25)
  Top 0.127: v53.98,21.21 v49.78,21.21 | v49.4,10.79 v47.88,10.79 | v47.62,8.38 44.45,8.38 44.07,8.38 43.12,8.38 K1.26
  Bottom 0.127: SX35.1 54.61,22.48 53.98,21.84 v53.98,21.21 | v49.78,21.21 49.78,12.83 49.4,12.45 v49.4,10.79 | v47.88,10.79 47.88,9.65 47.62,9.4 v47.62,8.38
N$47  (via drill 0.25)
  Top 0.127: 55.63,8.38 v55.75,8.51 55.37,8.13 54.86,8.13 51.69,8.13 51.29,8.13 51.03,8.38 K1.41
  Bottom 0.127: SX36.1 57.15,20.19 55.75,18.8 v55.75,8.51
N$48  (via drill 0.25)
  Top 0.127: SX37.1 58.42,22.86 v45.85,22.86 | v45.85,19.3 45.59,19.56 45.47,19.68 45.34,19.81 45.13,19.81 K1.1
  Bottom 0.127: v45.85,22.86 v45.85,19.3
N$49
  Top 0.127: SX39.1 59.94,21.84 55.86,21.84 K1.56
N$50
  Top 0.127: SX41.1 61.85,21.21 56.39,21.21 | 56.39,21.21 56.26,21.21 | K1.55 55.94,21.21 56.39,21.21
N$51  (via drill 0.25)
  Top 0.127: v64.9,17.65 63.75,17.65 63.5,17.4 53.53,17.4 K1.53
  Bottom 0.127: SX43.1 64.77,7.11 65.15,7.49 65.15,14.22 65.15,14.99 64.9,15.24 v64.9,17.65
N$52
  Top 0.127: R8.2 P1.-
N$53
  Top 0.127: SX3.1 12.32,20.7 14.22,20.7 14.73,20.7 18.16,17.27 26.16,17.27 27.3,16.13 R4.2 28.07,15.24 30.61,15.24 30.99,14.86 C6.2 31.5,14.48 31.62,14.48 32.26,13.84 32.77,13.84 34.29,13.84 C7.2 35.69,15.24 35.81,15.24 35.94,15.24 C8.2 37.74,16 38.73,15.01 | 38.73,15.01 K1.16 | K1.15 39.32,15.14 39.22,15.24 38.99,15.24 38.76,15.01 38.73,15.01
N$54  (via drill 0.25)
  Top 0.127: v40.64,11.56 40.61,11.56 K1.18
  Route15 0.127: v40.64,11.56 40.77,11.56 43.18,11.56 43.31,11.68 44.32,11.68 44.7,12.06 47.37,12.06 47.75,11.68 50.8,11.68 51.05,11.43 52.2,11.43 52.96,12.19 59.31,12.19 60.07,11.43 65.91,11.43 66.17,11.43 v67.31,11.43
  Bottom 0.127: SX52.1 v67.31,11.43
N$55  (via drill 0.25)
  Top 0.127: v49.15,14.48 48.64,13.97 44.32,13.97 43.69,14.61 42.69,14.61 K1.11
  Bottom 0.127: SX51.1 49.53,3.05 49.15,3.43 49.15,8.76 48.77,9.14 48.77,12.32 48.9,12.45 49.02,12.57 49.28,12.83 v49.15,14.48
N$57  (via drill 0.25)
  Top 0.127: SX49.1 54.61,2.41 53.34,3.68 52.32,3.68 51.31,4.7 50.16,4.7 49.91,4.45 47.5,4.45 47.12,4.06 v45.97,4.06 | v46.23,6.99 45.09,6.99 44.07,8 43.42,8 K1.27
  Bottom 0.127: v45.97,4.06 45.97,5.33 46.23,5.59 46.48,5.84 46.48,6.73 v46.23,6.99
N$58  (via drill 0.25)
  Top 0.127: K1.42 51.5,8.64 51.62,8.51 51.94,8.51 54.23,8.51 54.36,8.64 54.74,9.02 56.13,9.02 v57.53,7.87
  Bottom 0.127: SX48.1 57.15,6.22 57.66,6.73 v57.53,7.87
N$59  (via drill 0.25)
  Top 0.127: v58.55,22.35 v43.56,22.35 | v42.55,19.56 43.18,19.56 43.31,19.68 43.97,19.68 K1.2
  Bottom 0.127: SX47.1 59.69,5.59 59.44,5.84 59.44,16.38 58.55,17.27 v58.55,22.35 | v43.56,22.35 42.55,21.34 v42.55,19.56
N$60  (via drill 0.25)
  Top 0.127: v60.71,18.03 53.45,18.03 K1.54
  Bottom 0.127: v60.71,18.03 60.71,12.57 60.71,12.45 60.71,6.48 62.23,4.95 SX45.1
N$61  (via drill 0.25)
  Top 0.127: 6.48,24 SX2.1 | 15.24,16.38 v14.99,16.13
  Top 0.305: 6.48,24 6.48,21.84 7.11,21.21 SJ1.2 14.1,19.05 15.24,17.91 15.24,16.38 | v14.99,16.13 15.24,16.38 | C1.1 15.24,16.38
  Bottom 0.305: T1.1 15.88,15.24 v14.99,16.13
N$63
  Top 0.127: SX46.1 65.28,7.62 R7.2
N$64  (via drill 0.25)
  Top 0.127: v19.05,18.16 39.82,18.16 K1.10
  Bottom 0.127: SX12.1 v19.05,18.16
N$65  (via drill 0.25)
  Top 0.127: v18.03,18.67 40.03,18.67 K1.9
  Bottom 0.127: SX14.1 16.51,21.59 17.4,20.7 18.03,20.07 v18.03,18.67
N$67
  Top 0.127: R1.2 1.91,22.86
  Top 0.305: 1.91,22.86 2.16,23.24 2.92,23.24 SX1.1 3.94,24 3.94,21.21 5.59,19.56 SJ1.1
N$68  (via drill 0.25)
  Top 0.127: v51.44,6.99 54.36,6.99 C9.1 55.12,7.62 56.9,7.62 57.4,7.11 57.78,6.73 R7.3 | v51.31,12.06 51.05,12.32 v42.55,12.32 | K1.21 41.84,10.67 42.16,10.67 v42.67,10.67
  Bottom 0.127: v51.44,6.99 51.44,9.65 51.31,9.78 v51.31,12.06 | v42.55,12.32 v42.67,10.67
N$69  (via drill 0.25)
  Top 0.127: 19.98,5.84 K2.4 19.98,8.08 19.81,8.26 19.68,8.38 v19.68,9.14 | 19.98,5.84 19.98,5.17 C12.1 | K2.3 19.18,6.09 19.43,5.84 19.98,5.84 | K1.48 53.67,11.68 v53.72,11.68 54.1,11.68 C5.1 | K1.7 42.29,17.84 42.29,18.16 42.29,18.54 42.93,19.18 43.76,19.18 K1.3 44.77,18.16 45.34,18.16 45.59,18.41 v46.48,18.41 | K1.30 43.38,5.84 v40.64,5.84 40.01,5.21 C4.1 | v28.83,9.27 28.83,11.3 29.08,11.56 29.08,13.72 R2.2 | R7.1 v60.71,4.95
  Top 0.305: C2.1 13.84,8.76 v13.59,9.14
  Route15 0.127: v60.07,9.14 58.93,10.29 58.93,10.67
  Route15 0.305: SX44.1 68.33,10.16 67.18,9.02 v66.17,9.02 64.77,9.02 62.87,10.92 59.18,10.92 58.93,10.67 56.77,10.67 56.39,10.29 55.88,10.29 v55.12,9.53 54.1,9.53 53.59,9.02 v46.1,9.02 45.47,9.02 44.83,8.38 42.29,8.38 41.66,9.02 v39.88,9.02 34.42,9.02 34.16,9.27 v28.83,9.27 28.07,9.27 27.94,9.14 v19.68,9.14 v13.59,9.14
  Bottom 0.127: v40.64,5.84 40.64,7.49 39.88,8.26 v39.88,9.02 | v60.71,4.95 60.71,5.97 60.07,6.6 v60.07,9.14 | v46.1,9.02 46.1,14.86 46.48,15.24 v46.48,18.41
  Bottom 0.305: SX34.1 52.07,18.29 53.72,16.64 v53.72,11.68 54.36,11.68 55.12,10.92 v55.12,9.53 | v66.17,9.02 66.17,16.51 67.31,17.65 SX54.1 | T1.3 14.61,9.78 13.97,9.14 v13.59,9.14 13.59,10.54 11.43,12.7 SX4.1
N$70  (via drill 0.25)
  Top 0.127: SX57.1 11.43,3.81 22.73,3.81 23.11,4.19 v23.88,4.19 | 23.37,13.21 v23.24,13.08 23.53,13.37 K2.15 | K1.25 43.03,9.02 43.18,9.02 43.56,9.02 v43.69,9.02
  Route15 0.127: v23.24,13.08 23.75,13.08 23.88,12.95 24,12.83 32.13,12.83 33.15,13.84 41.15,13.84 41.66,13.34 v43.81,13.34
  Bottom 0.127: v23.88,4.19 24.13,4.45 24.13,5.46 24.13,5.59 23.24,6.48 v23.24,13.08 | v43.81,13.34 43.81,12.7 44.07,12.45 44.07,9.4 v43.69,9.02

### Text on the board
tPlace: VUSB | VIN | AGND | 3.3V | AREF | A10 | A11 | 23 | 22 | 21 | 20 | 19 | 18 | 17 | 16 | 15 | 14 | 13 | A13 | 3.3V | 33 | 32 | 31 | 30 | 29 | 3.3V | GND | A9 | A8 | A7 | A6 | A5 | A4 | A3 | A2 | A1 | A0 | RESET | PROG | GND | 3.3V | VBAT | GND | EN' | SWC | SWD | RST | GND | 0 | 1 | 2 | 3 | 4 | 5 | 6 | 7 | 8 | 9 | 10 | 11 | 12 | A12 | GND | 24 | 25 | 26 | 27 | 28 | DAC | GND
214bmp: C:/Users/thewknd/Downloads/007e0f56466427b007f6ee7495ea7904 (2)/board.bmp